# Altium schematic sheet v1.0.SchDoc
size 46 x 45 mm
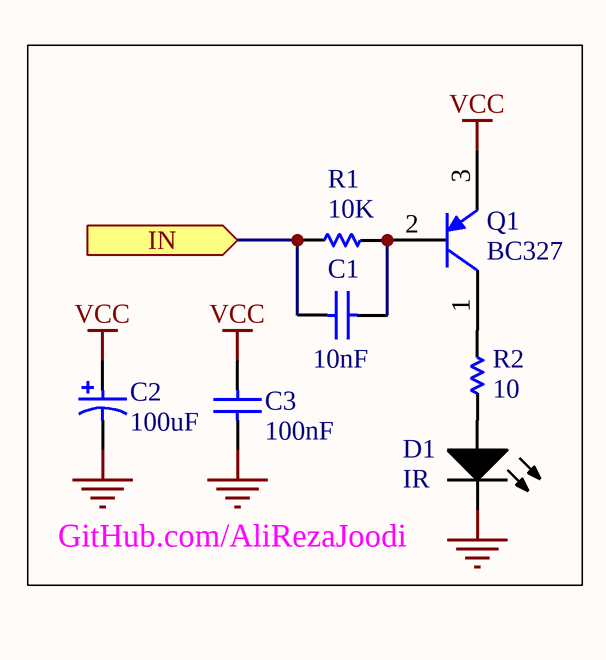
[diagram p0: v1.0.SchDoc]

## Parts
C1  10nF  [C_THD_CER_(P2.54-D3.5-T1.5)]
C2  100uF  [C_THD_EL_(P2.54-D6-H11)]
C3  100nF  [C_THD_CER_(P2.54-D3.5-T1.5)]
D1  IR  [LED_THD_5MM_GREEN]
Q1  BC327
R1  10K  [R_THD_AXIAL0.4(1/4W)]
R2  10  [R_THD_AXIAL0.4(1/4W)]

## Ports
IN (in)

## Nets
GND: C2.2 C3.2 D1.2(K)
VCC: C2.1 C3.1 Q1.3(E)
IN: C1.1 R1.2 ; port IN
NetC1_2: C1.2 Q1.2(B) R1.1
NetD1_1: D1.1(A) R2.1
NetQ1_1: Q1.1(C) R2.2

## Notes on the sheet
- GitHub.com/AliRezaJoodi

## Library data of the parts
C1 C3 = Capacitor_Ceramic: Capacitor, Ceramic Multilayer; Revision: July-2002: Re-released for DXP Platform.
C2 = Capacitor_Electrolytic: Capacitor, Electrolytic; Revision: July-2002: Re-released for DXP Platform.
D1 = LED: Manufacturer: Generic Components; Class I: Optoelectronic; Published: 8-Jun-2000; Revision: July-2002: Re-released for DXP Platform.; Publisher: Altium Limited; Class II: LED
Q1 = Transistor_BJT_PNP: Transistor, BJT, PNP; Package Reference: TO-92A
R1 R2 = Resistor: Revision: July-2002: Re-released for DXP Platform.